# EAGLE design Transistor controlled bell switch (EAGLE 9.6.2)
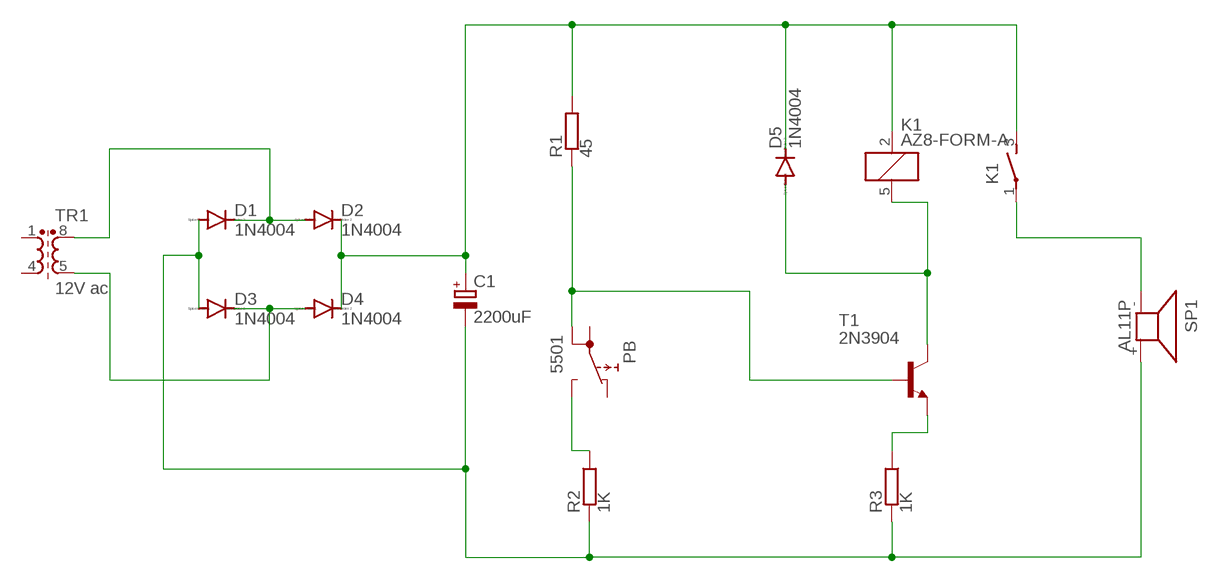
[diagram p0: schematic, sheet 1]

## Parts
C1  2200uF  CPOL-EU085CS-1AR  [085CS_1AR]
D1  1N4004  [DO41-10]
D2  1N4004  [DO41-10]
D3  1N4004  [DO41-10]
D4  1N4004  [DO41-10]
D5  1N4004  [DO41-10]
K1  AZ8-FORM-A  [AZ8]
PB  5501  [5501]
R1  45  PMD  [PMD]
R2  1K  PMD  [PMD]
R3  1K  PMD  [PMD]
SP1  AL11P  [AL11P]
T1  2N3904  [TO92]
TR1  12V ac  SMR6-2W  [SM-R6]

## Nets
N$1: D1.C D2.A TR1.8
N$2: PB.NO R2.1
N$3: D3.C D4.A TR1.5
N$4: PB.1B R1.2 T1.2(B)
N$5: C1.- D1.A D3.A R2.2 R3.2 SP1.+
N$6: C1.+ D2.C D4.C D5.C K1.2 K1.3(-1:S) R1.1
N$7: R3.1 T1.3(E)
N$11: D5.A K1.5 T1.1(C)
N$12: K1.1(-1:P) SP1.-
Unconnected: PB.1A PB.NC TR1.1 TR1.4

## Library data of the parts
C1 = rcl:CPOL-EU: POLARIZED CAPACITOR, European symbol; SPICEPREFIX: C
D1-D5 = diode:1N4004: DIODE general purpose rectifier, 1 A
K1 = relay:AZ8-FORM-A: MINIATURE PC BOARD RELAY Form A Source: www.azettler.com .. AZ8-1ch-12DSE.PDF; OC_FARNELL: unknown; OC_NEWARK: unknown
PB = switch:55?: PUSHBUTTON SERIES 5500 SWITCHES Source: www.e-switch.com .. 5500.pdf
R1-R3 = resistor-shunt:PMD: SMD SHUNT RESISTOR; OC_FARNELL: unknown; OC_NEWARK: unknown
SP1 = buzzer:AL11P: SPEAKER Source: Buerklin; OC_FARNELL: unknown; OC_NEWARK: unknown
T1 = transistor:2N3904: NPN TRANSISTOR
TR1 = inductor-neosid:SMR6-2W: TRANSFORMER SMD toroidal-core transformer with 2 windings; OC_FARNELL: unknown; OC_NEWARK: unknown

## Board
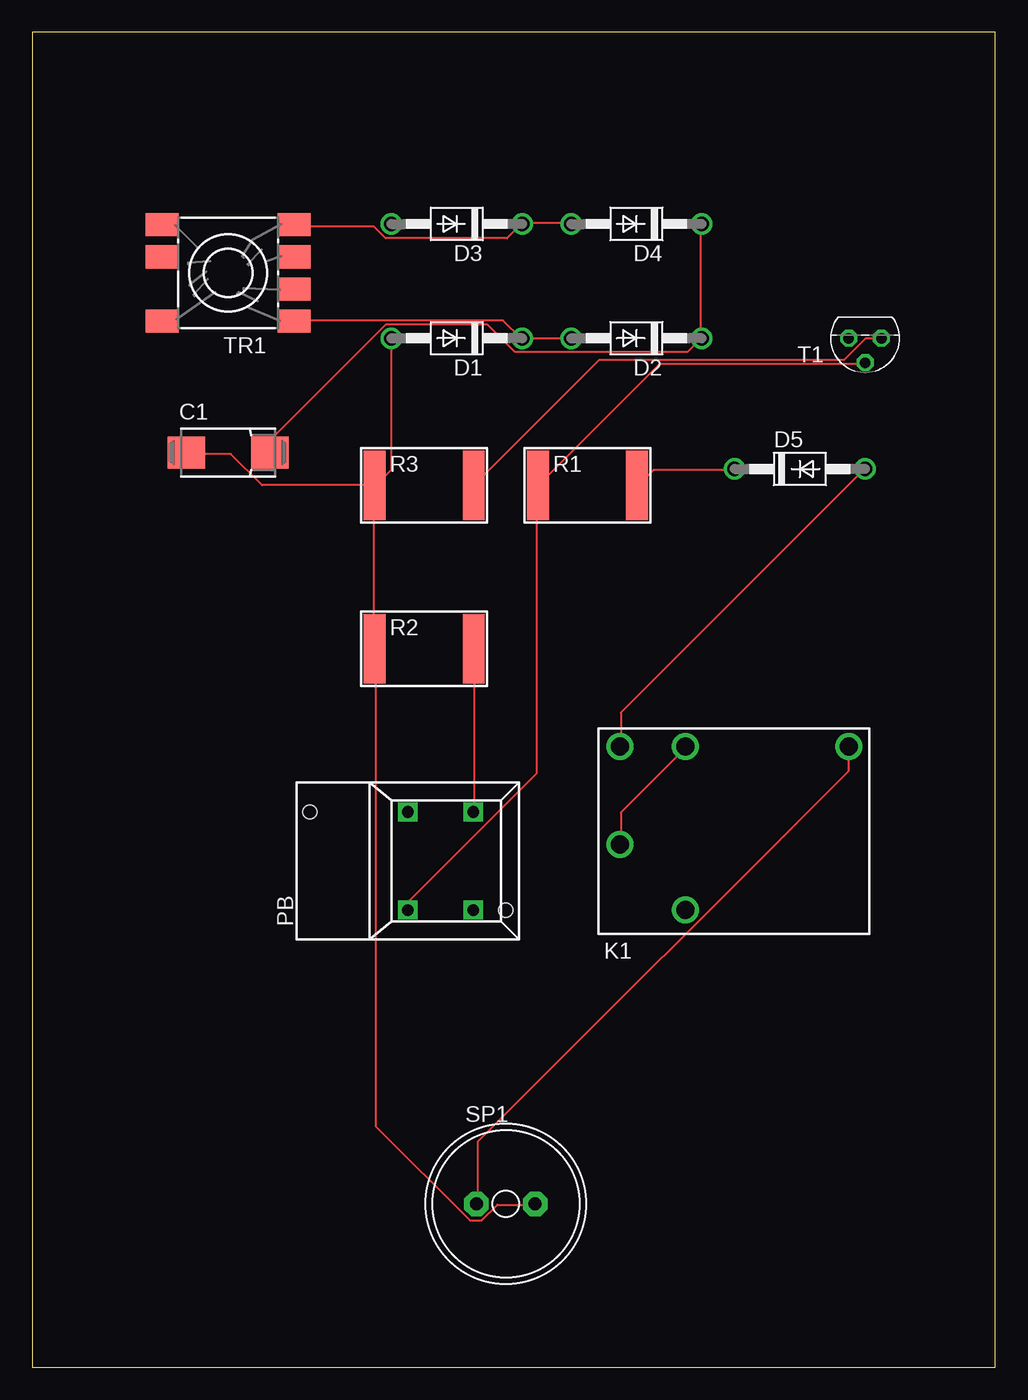
[diagram p1: board, top side]
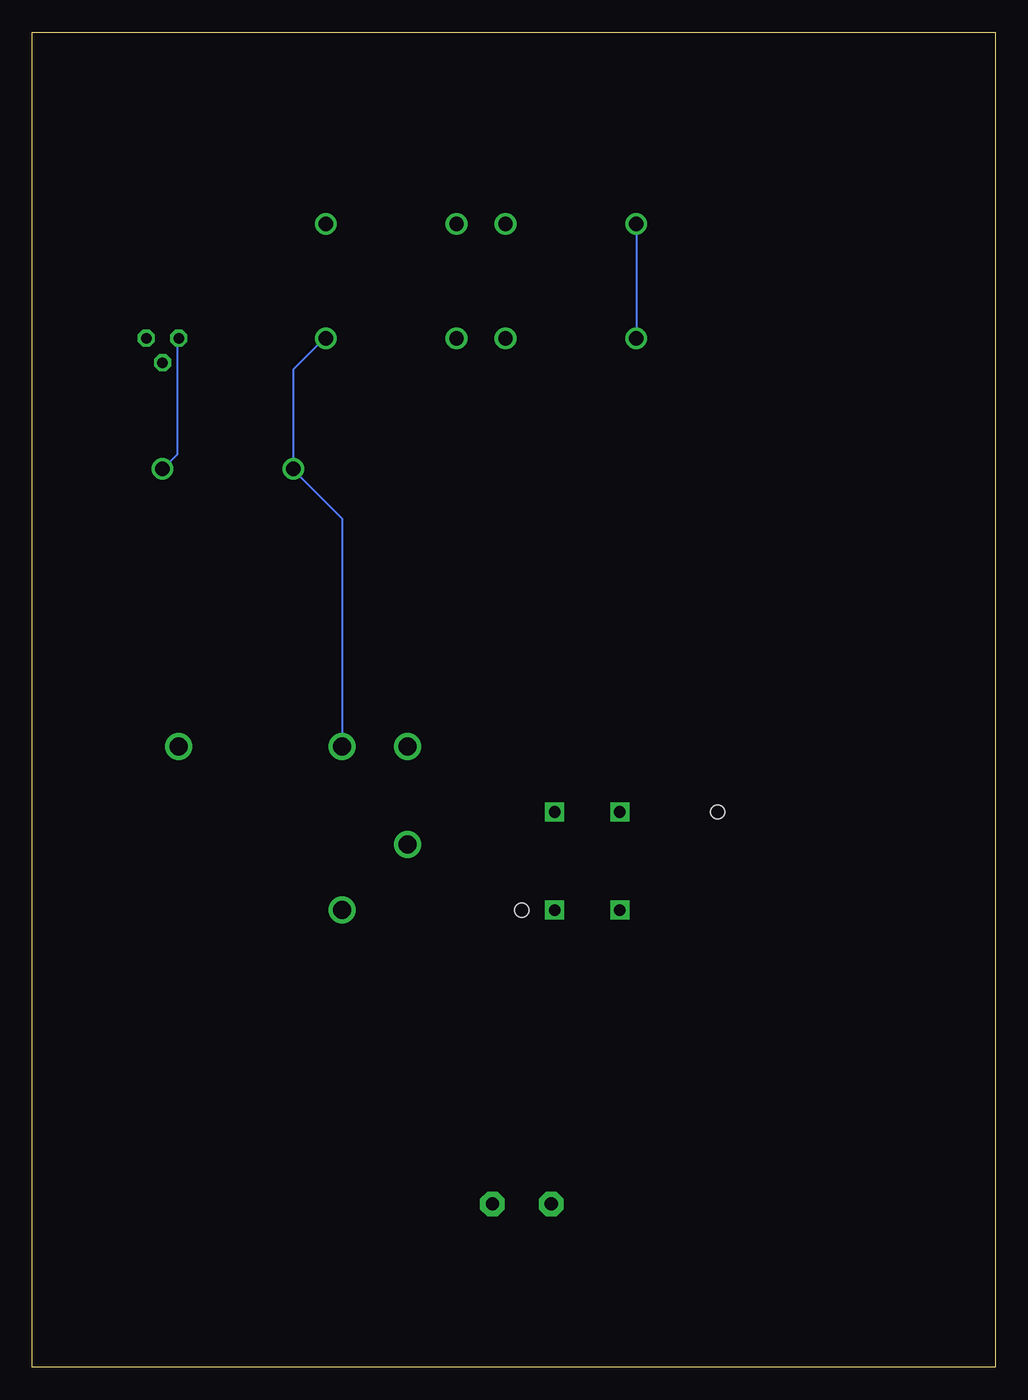
[diagram p2: board, bottom side, seen from below]

Size 74.91 x 103.81 mm. Coordinates in mm from the lower left corner, seen from the top.
Outline: 0,0 74.91,0 74.91,103.81 0,103.81 0,0
Copper layers (1*16): Top 0.035mm / dielectric 1.5mm / Bottom 0.035mm
Design rules "default": minimum track width 6mil, minimum drill 0.35mm, track to track 6mil, track to pad 6mil, pad to pad 6mil, via to via 6mil, smd to smd 6mil, copper to edge 40mil, drill to drill 6mil, minimum pad ring 10mil, minimum via ring 8mil, stop-mask expansion 4mil, vias tented up to drill 0mil, thermal gap 10mil

### Footprints (pad centres in the part's own frame; a part is rotated, then mirrored left to right if it is on the bottom)
085CS_1AR = smd 2.9 x 2.5: + 3.25,0; - -3.25,0
DO41-10 = drill 1.118: A 5.08,0; C -5.08,0
AZ8 = drill 1.4 pad 2: 1 8.89,6.35; 2 -3.81,6.35; 3 -8.89,-1.27; 4 -3.81,-6.35; 5 -8.89,6.35
5501 = drill 0.9 pad 1.5 square: 1A 0,3.81; 1B 0,-3.81; NC 5.08,-3.81; NO 5.08,3.81 | hole 1.1: -7.62,3.81; 7.62,-3.81
PMD = smd 1.7 x 5.4: 1 3.861,0; 2 -3.861,0
AL11P = drill 1.016 pad 1.905 octagon: + 2.286,0; - -2.286,0
TO92 = drill 0.813 octagon: 1 1.27,0; 2 0,1.905; 3 -1.27,0
SM-R6 = smd 1.8 x 2.55: 1 -3.75,5.125; 3 1.25,5.125; 4 3.75,5.125; 5 3.75,-5.125; 6 1.25,-5.125; 7 -1.25,-5.125; 8 -3.75,-5.125

### Placement (x,y rotation side)
C1  15.24,71.12 0 top
D1  33.02,80.01 180 top
D2  46.99,80.01 180 top
D3  33.02,88.9 180 top
D4  46.99,88.9 180 top
D5  59.69,69.85 0 top
K1  54.61,41.91 0 top
PB  29.21,39.37 0 top
R1  43.18,68.58 0 top
R2  30.48,55.88 0 top
R3  30.48,68.58 0 top
SP1  36.83,12.7 0 top
T1  64.77,80.01 180 top
TR1  15.24,85.09 90 top

### Tracks (layer width: path | path; a pad name or v marks a point on that pad's centre or on a via)
N$1
  Top 0.152: TR1.8 20.47,81.38 36.63,81.38 38,80.01 D1.C D2.A
N$2
  Top 0.152: R2.1 34.34,43.28 PB.NO
N$3
  Top 0.152: TR1.5 20.47,88.7 26.57,88.7 27.48,87.78 36.93,87.78 38,88.85 D3.C 38.15,89 41.81,89 D4.A
N$4
  Top 0.152: T1.2 64.67,78.03 48.82,78.03 39.37,68.58 R1.2 39.22,68.58 39.22,46.18 29.31,36.27 29.31,35.66 PB.1B
N$5
  Top 0.152: 26.57,68.58 17.88,68.58 15.44,71.02 12.09,71.02 C1.- | D1.A 27.94,69.8 26.72,68.58 R3.2 26.57,68.58 | SP1.+ 39.06,12.65 36.17,12.65 34.95,11.43 34.04,11.43 26.72,18.75 26.72,55.78 R2.2 26.57,55.93 26.57,68.58
  Bottom 0.152: D3.A D1.A
N$6
  Top 0.152: K1.3 45.77,40.69 45.77,43.13 50.8,48.16 K1.2 | D5.C 54.61,69.8 48.36,69.8 47.14,68.58 R1.1 | 52.02,80.01 50.95,78.94 37.54,78.94 35.41,81.08 27.48,81.08 18.49,72.09 18.49,71.17 C1.+ | 52.02,80.01 52.02,88.85 D4.C | 52.02,80.01 D2.C
  Bottom 0.152: D2.C 52.17,80.01 54.61,77.57 D5.C 54.61,69.8 50.8,65.99 K1.2
N$7
  Top 0.152: T1.3 64.82,80.01 63.14,78.33 44.09,78.33 R3.1
N$11
  Top 0.152: K1.5 45.77,48.31 45.77,50.9 64.67,69.8 D5.A
  Bottom 0.152: D5.A 63.6,71.02 63.6,80.01 T1.1
N$12
  Top 0.152: SP1.- 34.65,12.8 34.65,17.53 63.45,46.33 63.45,48.16 K1.1